# EAGLE design mi-led (EAGLE 7.5.0)
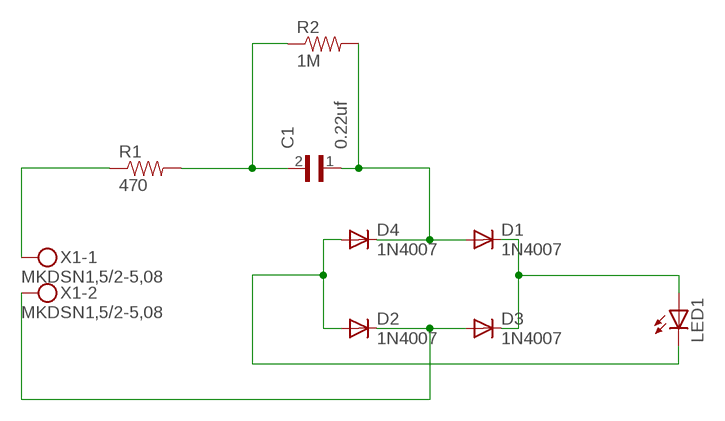
[diagram p0: schematic, sheet 1]

## Parts
C1  0.22uf  WCAP-FTX2_890324024003CS  [WCAP-FTX2_12.5X15X14X8.5]
D1  1N4007  1N4004  [DO41-10]
D2  1N4007  1N4004  [DO41-10]
D3  1N4007  1N4004  [DO41-10]
D4  1N4007  1N4004  [DO41-10]
LED1  LED5MM  [LED5MM]
R1  470  RESISTORPTH-1/2W  [AXIAL-0.5]
R2  1M  RESISTORPTH-1/2W  [AXIAL-0.5]
X1  MKDSN1,5/2-5,08  [MKDSN1,5/2-5,08]

## Nets
N$1: R1.P$1 X1.1
N$2: C1.2 R1.P$2 R2.P$1
N$3: D2.C D3.A X1.2
N$4: D1.C D3.C LED1.A
N$5: C1.1 D1.A D4.C R2.P$2
N$8: D2.A D4.A LED1.K(C)

## Library data of the parts
C1 = Eagle_Wurth_Elektronik_Passive_Capacitors_rev15a:WCAP-FTX2: WCAP-FTX2 Film Capacitors Characteristics MKP,Metallized Polypropylene Film Recommended soldering :Wave Operating temperature:-40 °C to +105 °C Climate category:40/105/56/B Self-healing properties Certificates: cULus, CQC, VDE Applications Safety applications Filter Power supplies <http://katalog.we-online.de/media/images/eisos/WCAP-FTX2_pf2.jpg> Details see: http://katalog.we-online.de/en/pbs/WCAP-FTX2/890324022007CS?m Created: 2015-01-22 2015 (C) Wurth Elektronik
D1-D4 = diode:1N4004: DIODE general purpose rectifier, 1 A
LED1 = adafruit:LED: LED OSRAM: - CHIPLED LG R971, LG N971, LY N971, LG Q971, LY Q971, LO R971, LY R971 LH N974, LH R974 LS Q976, LO Q976, LY Q976 LO Q996 - Hyper CHIPLED LW Q18S LB Q993, LB Q99A, LB R99A - SideLED LS A670, LO A670, LY A670, LG A670, LP A670 LB A673, LV A673, LT A673, LW A673 LH A674 LY A675 LS A676, LA A676, LO A676, LY A676, LW A676 LS A679, LY A679, LG A679 - Hyper Micro SIDELED® LS Y876, LA Y876, LO Y876, LY Y876 LT Y87S - SmartLED LW L88C, LW L88S LB L89C, LB L89S, LG L890 LS L89K, LO L89K, LY L89K LS L896, LA L896, LO L896, LY L896 - TOPLED LS T670, LO T670, LY T670, LG T670, LP T670 LSG T670, LSP T670, LSY T670, LOP T670, LYG T670 LG T671, LOG T671, LSG T671 LB T673, LV T673, LT T673, LW T673 LH T674 LS T676, LA T676, LO T676, LY T676, LB T676, LH T676, LSB T676, LW T676 LB T67C, LV T67C, LT T67C, LS T67K, LO T67K, LY T67K, LW E67C LS E67B, LA E67B, LO E67B, LY E67B, LB E67C, LV E67C, LT E67C LW T67C LS T679, LY T679, LG T679 LS T770, LO T770, LY T770, LG T770, LP T770 LB T773, LV T773, LT T773, LW T773 LH T774 LS E675, LA E675, LY E675, LS T675 LS T776, LA T776, LO T776, LY T776, LB T776 LHGB T686 LT T68C, LB T68C - Hyper Mini TOPLED® LB M676 - Mini TOPLED Santana® LG M470 LS M47K, LO M47K, LY M47K Source: http://www.osram.convergy.de/
R1 R2 = SparkFun-Resistors:RESISTOR: Resistor Basic schematic elements and footprints for 0603, 1206, and PTH resistors.
X1 = con-phoenix-508:MKDSN1,5/2-5,08: MKDSN 1,5/ 2-5,08 Printklemme Nennstrom: 13,5 A Nennspannung: 250 V Rastermaß: 5,08 mm Polzahl: 2 Anschlussart: Schraubanschluss Montage: Löten Anschlussrichtung Leiter/Platine: 0 ° Artikelnummer: 1729128 Source: http://eshop.phoenixcontact.com .. 1729128.pdf

## Board
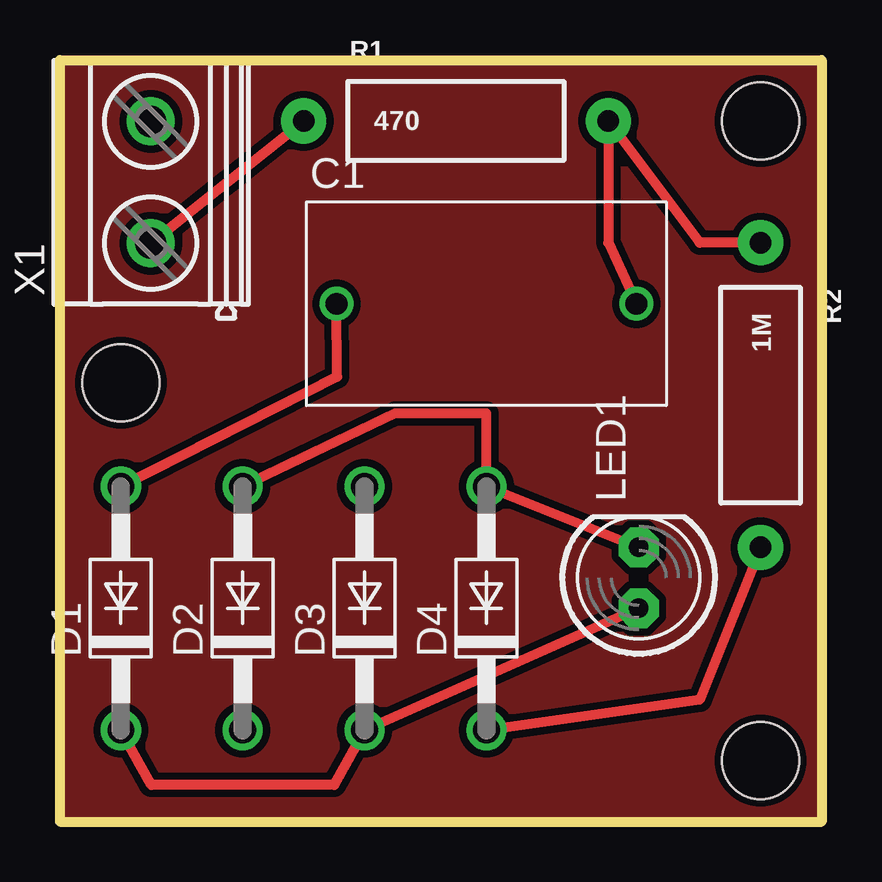
[diagram p1: board, top side]
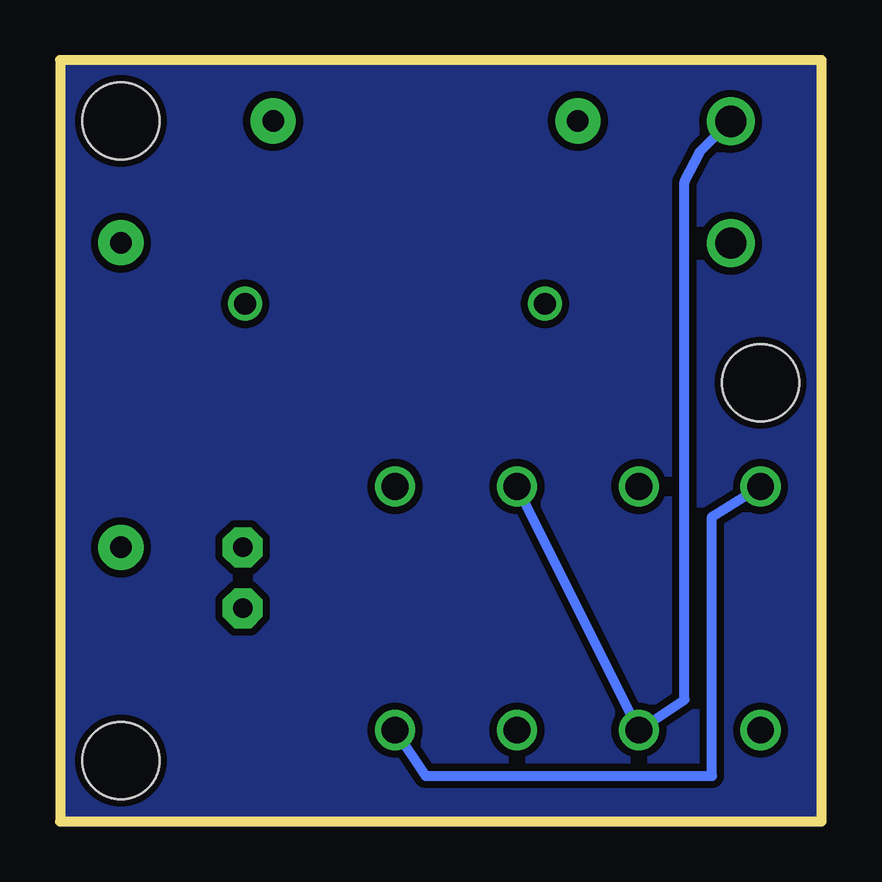
[diagram p2: board, bottom side, seen from below]

Size 31.75 x 31.75 mm. Coordinates in mm from the lower left corner, seen from the top.
Outline: 0,31.75 31.75,31.75 31.75,0 0,0 0,31.75
Copper layers (1*16): Top 0.035mm / dielectric 1.5mm / Bottom 0.035mm
Design rules "default *": minimum track width 10mil, minimum drill 24mil, track to track 8mil, track to pad 8mil, pad to pad 8mil, via to via 8mil, smd to smd 8mil, copper to edge 0mil, drill to drill 8mil, minimum pad ring 10mil, minimum via ring 8mil, stop-mask expansion 4mil, vias tented up to drill 0mil, thermal gap 10mil
Holes 3.2 mm at 29.21,2.54 29.21,29.21 2.54,18.29

### Footprints (pad centres in the part's own frame; a part is rotated, then mirrored left to right if it is on the bottom)
WCAP-FTX2_12.5X15X14X8.5 = drill 0.9: 1 -6.25,0; 2 6.25,0
DO41-10 = drill 1.118: A 5.08,0; C -5.08,0
LED5MM = drill 0.813 pad 1.676 octagon: A -1.27,0; K 1.27,0
AXIAL-0.5 = drill 0.9 pad 1.88: P$1 -6.35,0; P$2 6.35,0
MKDSN1,5/2-5,08 = drill 1.3 pad 2: 1 -2.561,0.025; 2 2.519,0.025

### Placement (x,y rotation side)
C1  17.78,21.59 0 top
D1  2.54,8.89 90 top
D2  7.62,8.89 90 top
D3  12.7,8.89 90 top
D4  17.78,8.89 90 top
LED1  24.13,10.16 90 top
R1  16.51,29.21 0 top
R2  29.21,17.78 270 top
X1  3.81,26.67 90 top

### Tracks (layer width: path | path; a pad name or v marks a point on that pad's centre or on a via)
GND
  pour Top (isolate 0.406): 0,0 0,31.75 31.75,31.75 31.75,0
  pour Top (isolate 0.305): 0,0 0,31.75 31.75,31.75 31.75,0
  pour Bottom (isolate 0.305): 0,0 0,31.75 31.75,31.75 31.75,0
N$1
  Top 0.406: X1.1 10.16,29.19 R1.P$1
N$2
  Top 0.406: C1.2 22.86,24.13 R1.P$2 26.67,24.13 R2.P$1
N$3
  Bottom 0.406: X1.2 5.05,27.94 5.71,26.67 5.71,5.08 D2.C D3.A
N$4
  Top 0.406: LED1.A D3.C 11.43,1.52 3.81,1.52 D1.C
N$5
  Top 0.406: R2.P$2 26.67,5.08 D4.C | D1.A 11.56,18.54 C1.1
  Bottom 0.406: D4.C 16.51,1.91 4.57,1.91 4.57,12.7 D1.A
N$8
  Top 0.406: LED1.K D4.A 17.78,17.02 13.97,17.02 D2.A